# Altium project may_nong_lanh.PrjPcb
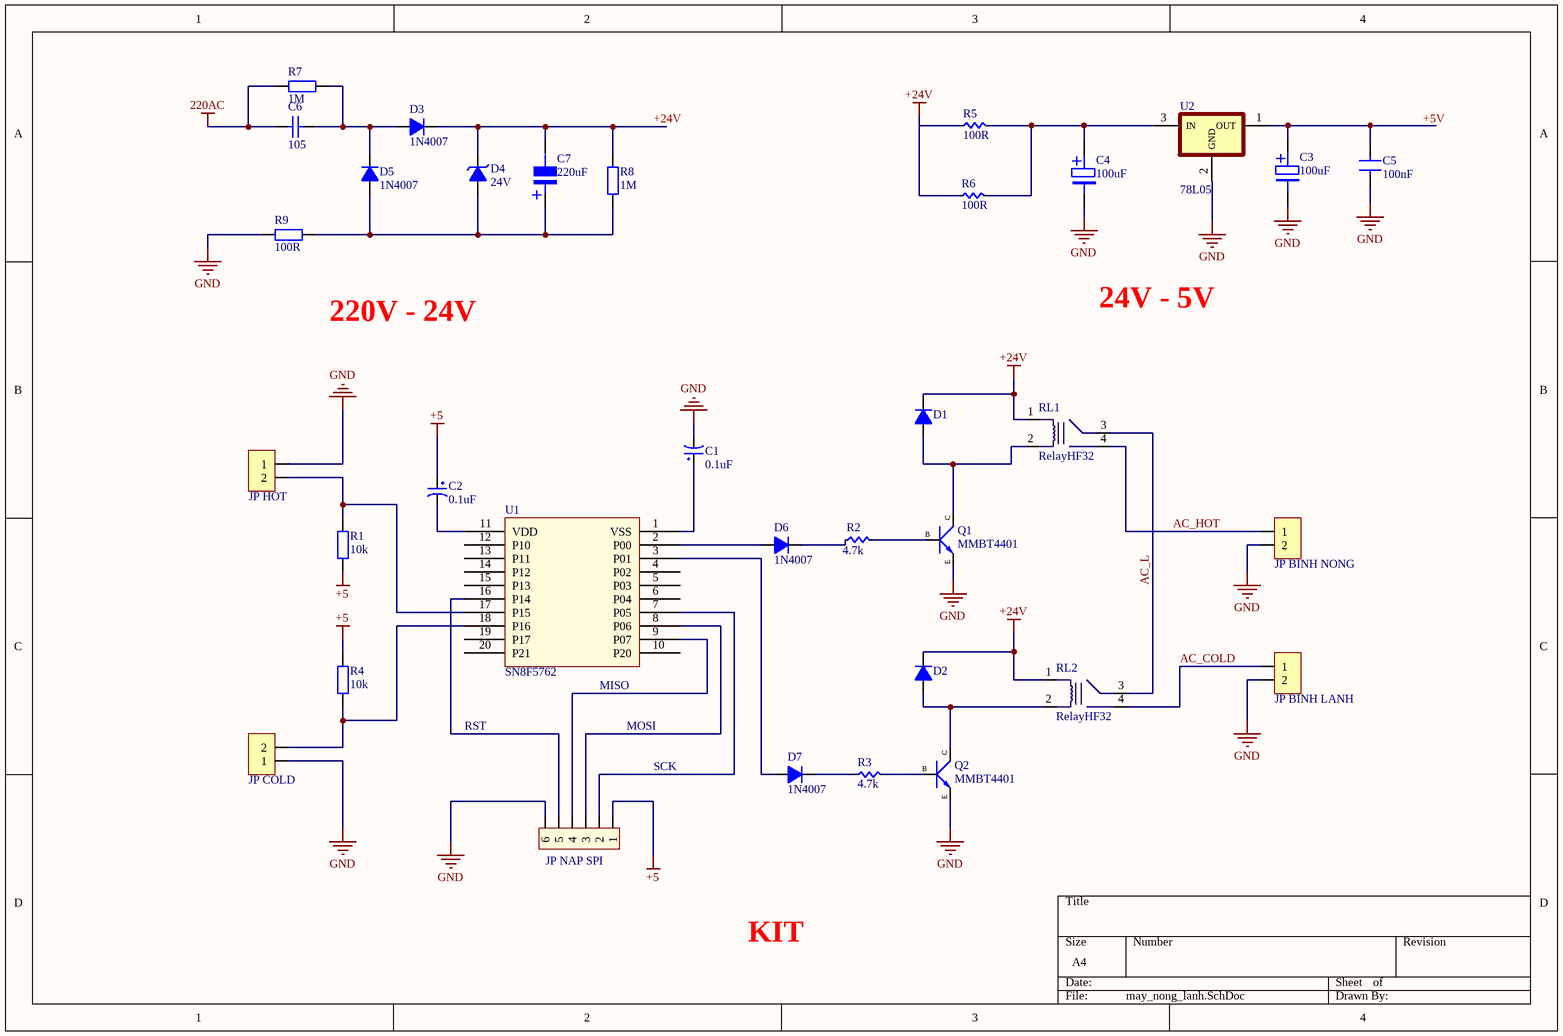
[diagram p0: may_nong_lanh.SchDoc]
1 sheet, 34 parts. Net scope: global (net labels, ports and power ports of the same name join across sheets).
Board file: may_nong_lanh.PcbDoc

## Sheet may_nong_lanh.SchDoc
size A4; SheetNumber: 1; SheetTotal: 1

### Parts
C1  0.1uF  [tu hoa 5mm]
C2  0.1uF  [tu hoa 5mm]
C3  100uF  [C_ALUM_TH_6.3X11MM_P2.5MM]
C4  100uF  [C_ALUM_TH_6.3X11MM_P2.5MM]
C5  100nF  [C_0603_H0.87]
C6  105  [tu 1206]
C7  220uF  [tu nhom 10 (g)]
D1  DIODE_1N4148W  [DIODE_1N4148W]  (value not drawn)
D2  DIODE_1N4148W  [DIODE_1N4148W]  (value not drawn)
D3  1N4007  [D1A]
D4  24V  [DIODE ZENNER SMD SOD80]
D5  1N4007  [D1A]
D6  1N4007  [D1A]
D7  1N4007  [D1A]
JP1  JP BINH NONG  [JP 1x2 DT]
JP2  JP HOT  [JP 1x2 DT]
JP3  JP BINH LANH  [JP 1x2 DT]
JP4  JP COLD  [JP 1x2 DT]
JP?  JP NAP SPI  [JP6]
Q1  MMBT4401  [TRANS-BJT_MMBT4401]
Q2  MMBT4401  [TRANS-BJT_MMBT4401]
R1  10k  [tro cong suat 10w]
R2  4.7k  [R_0603_H0.53]
R3  4.7k  [R_0603_H0.53]
R4  10k  [tro cong suat 10w]
R5  100R  [R_2512_H0.47]
R6  100R  [R_2512_H0.47]
R7  1M  [tro vach 2w]
R8  1M  [tro vach 2w]
R9  100R  [tro vach 2w]
RL1  RelayHF32  [HF32FV-G/24-HSTF(590)]
RL2  RelayHF32  [HF32FV-G/24-HSTF(590)]
U1  SN8F5762
U2  78L05  [IC_78L05]

### Nets
220AC: C6.2 R7.1
+5: C2.1 JP?.1 R1.1 R4.2
+24V: D1.K D2.K R5.1 RL1.1 RL2.1
GND: C1.2 C3.N C4.N C5.2 JP1.2 JP2.1 JP3.2 JP4.1 JP?.6 Q1.E Q2.E R9.1 U2.2(GND)
AC_COLD: JP3.1 RL2.4(AC/DC)
AC_HOT: JP1.1 RL1.4(AC/DC)
AC_L: RL1.3(AC/DC) RL2.3(AC/DC)
NetC1_1: C1.1 U1.1(VSS)
NetC2_2: C2.2 U1.11(VDD)
NetC3_P: C3.P C5.1 U2.1(OUT)
NetC4_P: C4.P R5.2 R6.2 U2.3(IN)
NetC6_1: C6.1 D3.1(A) D5.2(K) R7.2
NetC7_1: C7.1 D4.1(A) D5.1(A) R8.1 R9.2
NetC7_2: C7.2 D3.2(K) D4.2(K) R8.2
NetD1_A: D1.A Q1.C RL1.2
NetD2_A: D2.A Q2.C RL2.2
NetD6_1: D6.1(A) U1.2(P00)
NetD6_2: D6.2(K) R2.1
NetD7_1: D7.1(A) U1.3(P01)
NetD7_2: D7.2(K) R3.1
NetJP2_2: JP2.2 R1.2 U1.17(P15)
NetJP4_2: JP4.2 R4.1 U1.18(P16)
NetJP?_2: JP?.2 U1.7(P05)
NetJP?_3: JP?.3 U1.8(P06)
NetJP?_4: JP?.4 U1.9(P07)
NetJP?_5: JP?.5 U1.16(P14)
NetQ1_B: Q1.B R2.2
NetQ2_B: Q2.B R3.2

Not connected (* = marked no-connect by the designer): R6 1; U1 4(P02) 5(P03) 6(P04) 10(P20) 12(P10) 13(P11) 14(P12) 15(P13) 19(P17) 20(P21)

### Notes on the sheet
- +24V
- +5V
- 24V - 5V
- 220V - 24V
- (near U1) MISO
- RST
- MOSI
- SCK
- KIT
- (in symbol Tu Nhom 100uF 35V) +
- (in symbol Tu Nhom 220uF 50V) +

### Library data of the parts
C1 C2 = Tu Hoa 0.1uF 50V 5x11: Cắm; Don_Vi: Con; So_Chan: 2; Ten_Linh_Kien: Tụ Hóa 0.1uF 50V; Ma_Hang: MH006853; Chung_Loai: Cắm; Kieu_Chan: *
C3 C4 = Tu Nhom 100uF 35V: Dán; Don_Vi: Con; Ten_Linh_Kien: Tụ Nhôm 100uF 35V; Ma_Hang: MH004019; So_Chan: 2; Chung_Loai: Dán; Kieu_Chan: *
C5 = C_0603_H0.87: Capacitor SMD 0603
C6 = Tu 1206 105 50V 20%: Dán; Don_Vi: Con; So_Chan: 2; Ten_Linh_Kien: Tụ 1206 105-1uF 20% 50V; Ma_Hang: MH004545; Chung_Loai: Dán; Kieu_Chan: *
C7 = Tu Nhom 220uF 50V: Dán; Don_Vi: Con; So_Chan: 2; Ten_Linh_Kien: Tụ Nhôm 220uF 50V 10x10.2MM; Ma_Hang: MH002228; Chung_Loai: Dán; Kieu_Chan: *
D1 D2 = DIODE_1N4148W: 0.7V; Value: 1N4148
D3 D5-D7 = D1A: Diode 1A; Value: 1N4007
D4 = Diode Zener 24V: Cắm; Don_Vi: Con; Ten_Linh_Kien: Diode Zener 1/2W 24V DIP 1N5252B; Ma_Hang: MH002878; Ghi_Chu: *; Kieu_Chan: *; Chung_Loai: Cắm
JP1-JP4 = JP 1x2 2.54 Duc Thang: Cắm; Ten_Linh_Kien: Jump Đơn Đực 2.54MM 1x40P Thẳng 11MM; Don_Vi: Con; Ma_Hang: MH000903; Ghi_Chu: *; Kieu_Chan: *; Chung_Loai: Cắm
JP? = JP6: JP6 PIN; Value: JP7
Q1 Q2 = TRANS-BJT_MMBT4401: 600mA, 40V; Value: BC337,BC337-16,BC337-25,BC337-40,BC338-25
R1 R4 = Tro Cong Suat 10W 5% 10k: Cắm; Don_Vi: Con; So_Chan: 2; Ten_Linh_Kien: Trở Sứ 10w 5% 10k; Ma_Hang: MH001117; Chung_Loai: Cắm; Kieu_Chan: *
R2 R3 = R_0603_H0.53: RES SMD 0603; Manufacturer: Vishay Dale; Manufacturer Part Number: CRCW040210K0FKED; Resistance (Ohms): 10k; Tolerance: ±1%; Power (Watts): 0.063W, 1/16W; Temperature Coefficient: ±100ppm/°C; Supplier 1: Digi-Key; RoHS: RoHS Compliant; Category: Resistors; Stock 1: 2392462; Pricing 1: 10=0.083, 50=0.0444, 200=0.0255, 1000=0.0174 (USD); Packaging: Cut Tape (CT); Composition: Thick Film; Features: Automotive AEC-Q200; Operating Temperature: -55°C ~ 155°C; Package / Case: 0402 (1005 Metric); Supplier Device Package: 0402 (1005 Metric); Size / Dimension: 0.039" L x 0.020" W (1.00mm x 0.50mm); Height: 0.016" (0.40mm); Number of Terminations: 2; ComponentLink1URL: http://www.vishay.com/docs/20035/dcrcwe3.pdf; ComponentLink1Description: http://www.vishay.com/docs/20035/dcrcwe3.pdf; Supplier Part Number 1: 541-10.0KLCT-ND
R5 R6 = R_2512_H0.47: RES SMD 0805; Manufacturer: Vishay Dale; Manufacturer Part Number: CRCW040210K0FKED; Resistance (Ohms): 10k; Tolerance: ±1%; Power (Watts): 0.063W, 1/16W; Temperature Coefficient: ±100ppm/°C; Supplier 1: Digi-Key; RoHS: RoHS Compliant; Category: Resistors; Stock 1: 2392462; Pricing 1: 10=0.083, 50=0.0444, 200=0.0255, 1000=0.0174 (USD); Packaging: Cut Tape (CT); Composition: Thick Film; Features: Automotive AEC-Q200; Operating Temperature: -55°C ~ 155°C; Package / Case: 0402 (1005 Metric); Supplier Device Package: 0402 (1005 Metric); Size / Dimension: 0.039" L x 0.020" W (1.00mm x 0.50mm); Height: 0.016" (0.40mm); Number of Terminations: 2; ComponentLink1URL: http://www.vishay.com/docs/20035/dcrcwe3.pdf; ComponentLink1Description: http://www.vishay.com/docs/20035/dcrcwe3.pdf; Supplier Part Number 1: 541-10.0KLCT-ND
R7 R8 = Tro Vach 2W 5% 1M: Cắm; Don_Vi: Con; So_Chan: 2; Ten_Linh_Kien: Trở 5% 2w 1M; Ma_Hang: MH006365; Chung_Loai: Cắm; Kieu_Chan: *
R9 = Tro Vach 2W 5% 100R: Cắm; Don_Vi: Con; So_Chan: 2; Ten_Linh_Kien: Trở 5% 2w 100R; Ma_Hang: MH006357; Chung_Loai: Cắm; Kieu_Chan: *
RL1 RL2 = HF32FV-G/24-HSTF(590): Relay 4 chan HF32; Ten: Relay 5V5A HF46F-G 5-HS1; Ma_Hang: MH003879
U1 = Component_1
U2 = IC78L05: 5VDC LDO; Value: LM7805